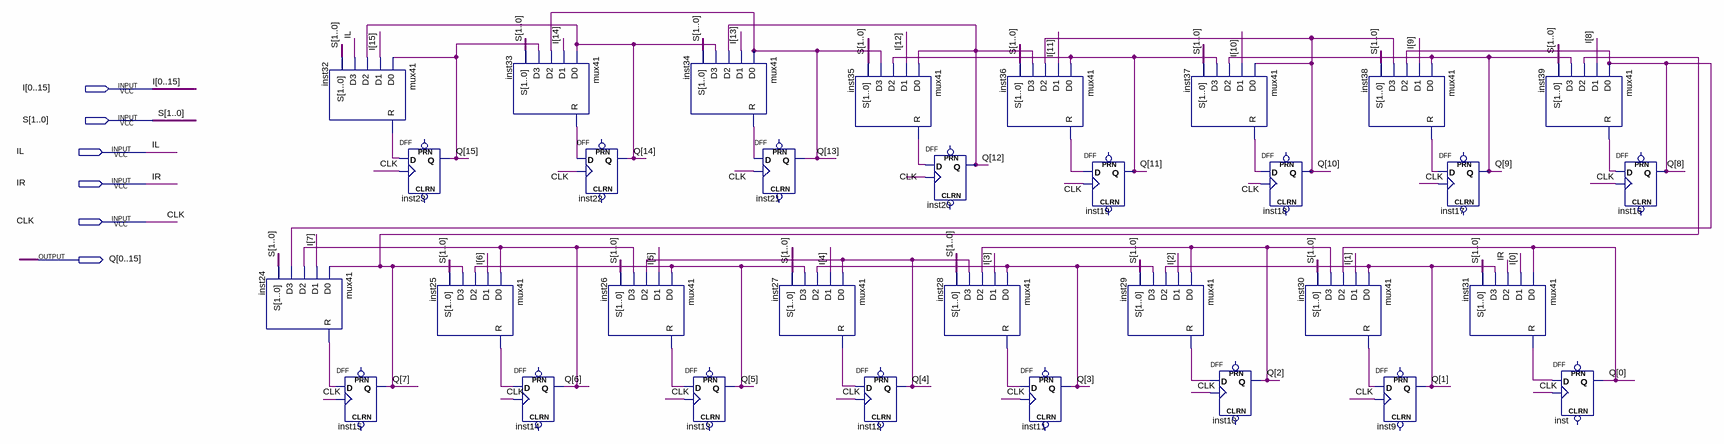
[diagram p0: schematic sheet]
// Quartus schematic shifter16bit.bdf as structural Verilog: 32 symbols, 6 pins
module shifter16bit (
  input  [0:15] I,
  input  [1:0] S,
  input  IL,
  input  IR,
  input  CLK,
  output [0:15] Q
);

  wire inst24_r, inst25_r, inst26_r, inst27_r, inst28_r, inst29_r, inst30_r, inst31_r, inst32_r, inst33_r,
       inst34_r, inst35_r, inst36_r, inst37_r, inst38_r, inst39_r;

  mux41 inst24 (.D0(Q[7]), .D1(I[7]), .D2(Q[6]), .D3(Q[8]), .S(S), .R(inst24_r));
  mux41 inst32 (.D0(Q[15]), .D1(I[15]), .D2(Q[14]), .D3(IL), .S(S), .R(inst32_r));
  DFF inst15 (.CLK(CLK), .D(inst24_r), .Q(Q[7]));  // open: CLRN, PRN
  DFF inst23 (.CLK(CLK), .D(inst32_r), .Q(Q[15]));  // open: CLRN, PRN
  mux41 inst25 (.D0(Q[6]), .D1(I[6]), .D2(Q[5]), .D3(Q[7]), .S(S), .R(inst25_r));
  mux41 inst33 (.D0(Q[14]), .D1(I[14]), .D2(Q[13]), .D3(Q[15]), .S(S), .R(inst33_r));
  DFF inst14 (.CLK(CLK), .D(inst25_r), .Q(Q[6]));  // open: CLRN, PRN
  DFF inst22 (.CLK(CLK), .D(inst33_r), .Q(Q[14]));  // open: CLRN, PRN
  mux41 inst26 (.D0(Q[5]), .D1(I[5]), .D2(Q[4]), .D3(Q[6]), .S(S), .R(inst26_r));
  mux41 inst34 (.D0(Q[13]), .D1(I[13]), .D2(Q[12]), .D3(Q[14]), .S(S), .R(inst34_r));
  DFF inst13 (.CLK(CLK), .D(inst26_r), .Q(Q[5]));  // open: CLRN, PRN
  DFF inst21 (.CLK(CLK), .D(inst34_r), .Q(Q[13]));  // open: CLRN, PRN
  mux41 inst27 (.D0(Q[4]), .D1(I[4]), .D2(Q[3]), .D3(Q[5]), .S(S), .R(inst27_r));
  mux41 inst35 (.D0(Q[12]), .D1(I[12]), .D2(Q[11]), .D3(Q[13]), .S(S), .R(inst35_r));
  DFF inst12 (.CLK(CLK), .D(inst27_r), .Q(Q[4]));  // open: CLRN, PRN
  DFF inst20 (.CLK(CLK), .D(inst35_r), .Q(Q[12]));  // open: CLRN, PRN
  mux41 inst28 (.D0(Q[3]), .D1(I[3]), .D2(Q[2]), .D3(Q[4]), .S(S), .R(inst28_r));
  mux41 inst36 (.D0(Q[11]), .D1(I[11]), .D2(Q[10]), .D3(Q[12]), .S(S), .R(inst36_r));
  DFF inst11 (.CLK(CLK), .D(inst28_r), .Q(Q[3]));  // open: CLRN, PRN
  DFF inst19 (.CLK(CLK), .D(inst36_r), .Q(Q[11]));  // open: CLRN, PRN
  mux41 inst29 (.D0(Q[2]), .D1(I[2]), .D2(Q[1]), .D3(Q[3]), .S(S), .R(inst29_r));
  mux41 inst37 (.D0(Q[10]), .D1(I[10]), .D2(Q[9]), .D3(Q[11]), .S(S), .R(inst37_r));
  DFF inst10 (.CLK(CLK), .D(inst29_r), .Q(Q[2]));  // open: CLRN, PRN
  DFF inst18 (.CLK(CLK), .D(inst37_r), .Q(Q[10]));  // open: CLRN, PRN
  mux41 inst30 (.D0(Q[1]), .D1(I[1]), .D2(Q[0]), .D3(Q[2]), .S(S), .R(inst30_r));
  mux41 inst38 (.D0(Q[9]), .D1(I[9]), .D2(Q[8]), .D3(Q[10]), .S(S), .R(inst38_r));
  DFF inst9 (.CLK(CLK), .D(inst30_r), .Q(Q[1]));  // open: CLRN, PRN
  DFF inst17 (.CLK(CLK), .D(inst38_r), .Q(Q[9]));  // open: CLRN, PRN
  mux41 inst31 (.D0(Q[0]), .D1(I[0]), .D2(IR), .D3(Q[1]), .S(S), .R(inst31_r));
  mux41 inst39 (.D0(Q[8]), .D1(I[8]), .D2(Q[7]), .D3(Q[9]), .S(S), .R(inst39_r));
  DFF inst (.CLK(CLK), .D(inst31_r), .Q(Q[0]));  // open: CLRN, PRN
  DFF inst16 (.CLK(CLK), .D(inst39_r), .Q(Q[8]));  // open: CLRN, PRN
endmodule
